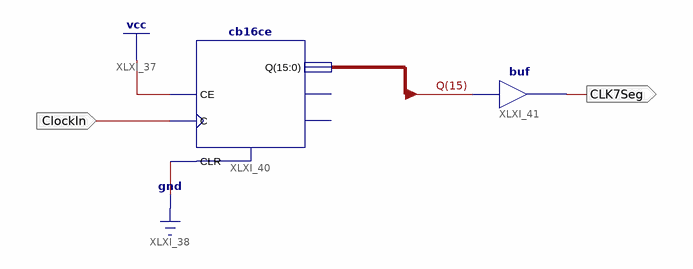
[diagram p0: schematic sheet 1]
// Xilinx ISE schematic ClockDivider.sch (spartan6) as structural Verilog: 2 symbols, 2 ports
module ClockDivider (
  input  ClockIn,
  output CLK7Seg
);

  wire [15:0] Q;

  cb16ce XLXI_40 (.C(ClockIn), .CE(1'b1), .CLR(1'b0), .Q(Q));  // open: CEO, TC
  buf XLXI_41 (CLK7Seg, Q[15]);
endmodule
